# Altium schematic sheet circuit board design v2.1.SchDoc
size 297 x 209 mm
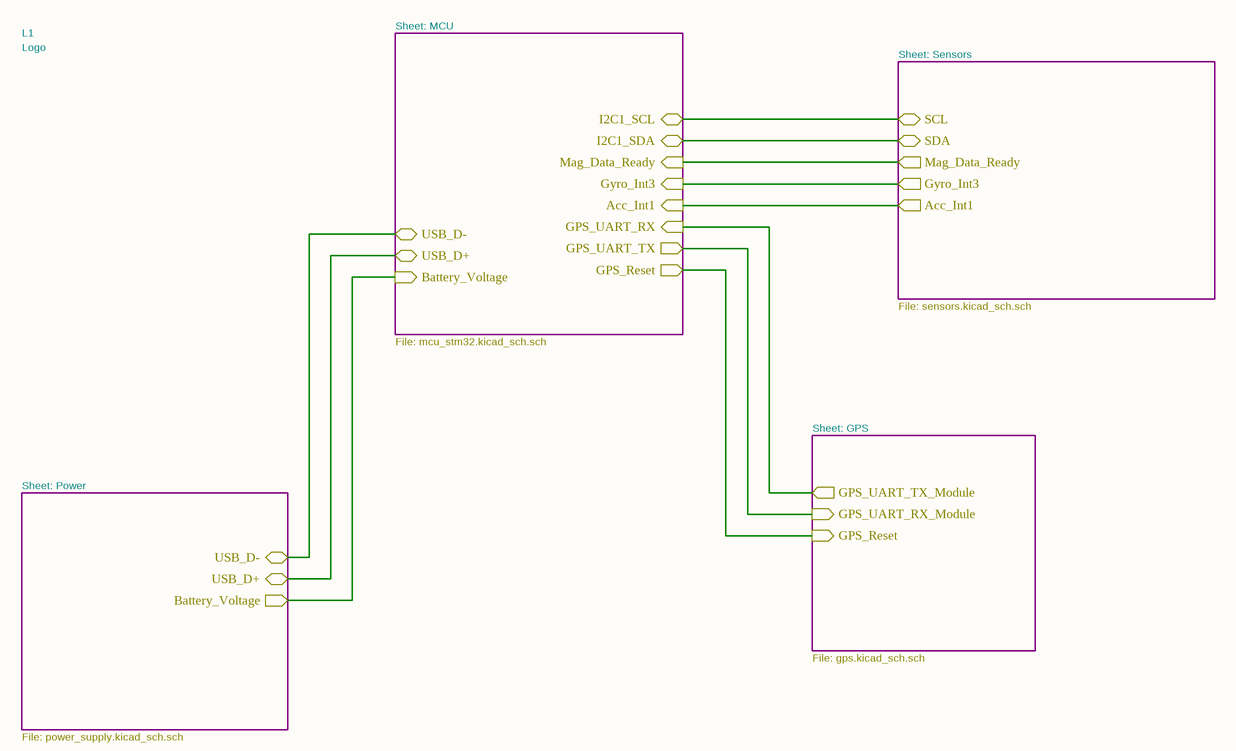
[diagram p0: circuit board design v2.1.SchDoc]

## Parts
L1  Logo  [ICSS_Logo]

## Sub-sheets
GPS = gps.SchDoc: GPS_Reset (in), GPS_UART_TX_Module (out), GPS_UART_RX_Module (in)
MCU = mcu_stm32.SchDoc: Battery_Voltage (in), GPS_UART_RX (in), GPS_UART_TX (out), GPS_Reset (out), USB_D- (bidir), USB_D+ (bidir), I2C1_SDA (bidir), I2C1_SCL (bidir), Acc_Int1 (in), Gyro_Int3 (in), Mag_Data_Ready (in)
Power = power_supply.SchDoc: Battery_Voltage (out), USB_D+ (bidir), USB_D- (bidir)
Sensors = sensors.SchDoc: SCL (bidir), SDA (bidir), Mag_Data_Ready (out), Acc_Int1 (out), Gyro_Int3 (out)

## Nets
(unnamed): sheet Sensors/SCL, sheet MCU/I2C1_SCL
(unnamed): sheet Sensors/SDA, sheet MCU/I2C1_SDA
(unnamed): sheet Sensors/Mag_Data_Ready, sheet MCU/Mag_Data_Ready
(unnamed): sheet Sensors/Acc_Int1, sheet MCU/Acc_Int1
(unnamed): sheet Sensors/Gyro_Int3, sheet MCU/Gyro_Int3
(unnamed): sheet Power/Battery_Voltage, sheet MCU/Battery_Voltage
(unnamed): sheet Power/USB_D+, sheet MCU/USB_D+
(unnamed): sheet Power/USB_D-, sheet MCU/USB_D-
(unnamed): sheet GPS/GPS_Reset, sheet MCU/GPS_Reset
(unnamed): sheet GPS/GPS_UART_TX_Module, sheet MCU/GPS_UART_RX
(unnamed): sheet GPS/GPS_UART_RX_Module, sheet MCU/GPS_UART_TX

## Notes on the sheet
- Sheet: MCU
- Sheet: Sensors
- File: mcu_stm32.kicad_sch.sch
- File: sensors.kicad_sch.sch
- Sheet: Power
- Sheet: GPS
- File: gps.kicad_sch.sch
- File: power_supply.kicad_sch.sch
- 1
- 2
- 3
- 4
- 5
- 6
- A
- B
- C
- D
- Title:
- File: circuit board design v2.1.kicad_sch
- Sheet: /
- KiCad E.D.A.  kicad (5.1.4)-1
- Size: A4
- Date:
- Rev:
- Id: 1/1

## Library data of the parts
L1 = Logo: Value: Logo; Footprint: Components:ICSS_Logo